# Altium schematic sheet MPU_ACC.SchDoc
size A4
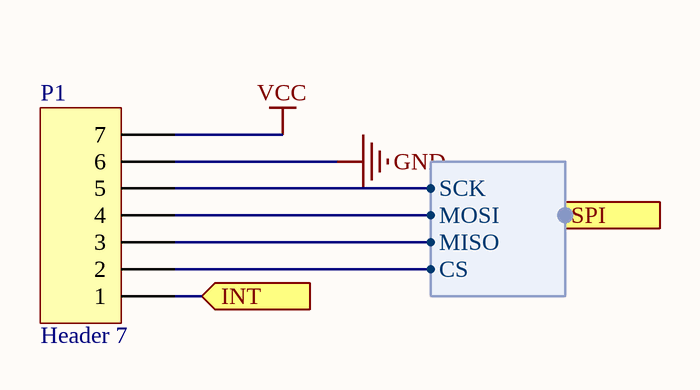
[diagram p0: MPU_ACC.SchDoc]

## Parts
P1  Header 7  [HDR1X7]

## Ports
INT (in), SPI (harness SPI)

## Harnesses
SPI: SCK, MOSI, MISO, CS

## Nets
GND: P1.6
VCC: P1.7
INT: P1.1 ; port INT
NetP1_2: P1.2 ; port SPI.CS
NetP1_3: P1.3 ; port SPI.MISO
NetP1_4: P1.4 ; port SPI.MOSI
NetP1_5: P1.5 ; port SPI.SCK

## Library data of the parts
P1 = Header 7: Header, 7-Pin; LatestRevisionDate: 17-Jul-2002; LatestRevisionNote: Re-released for DXP Platform.; Publisher: Altium Limited